# Altium schematic sheet SMPS.SchDoc
size A4; SheetNumber: 4; SheetTotal: 7
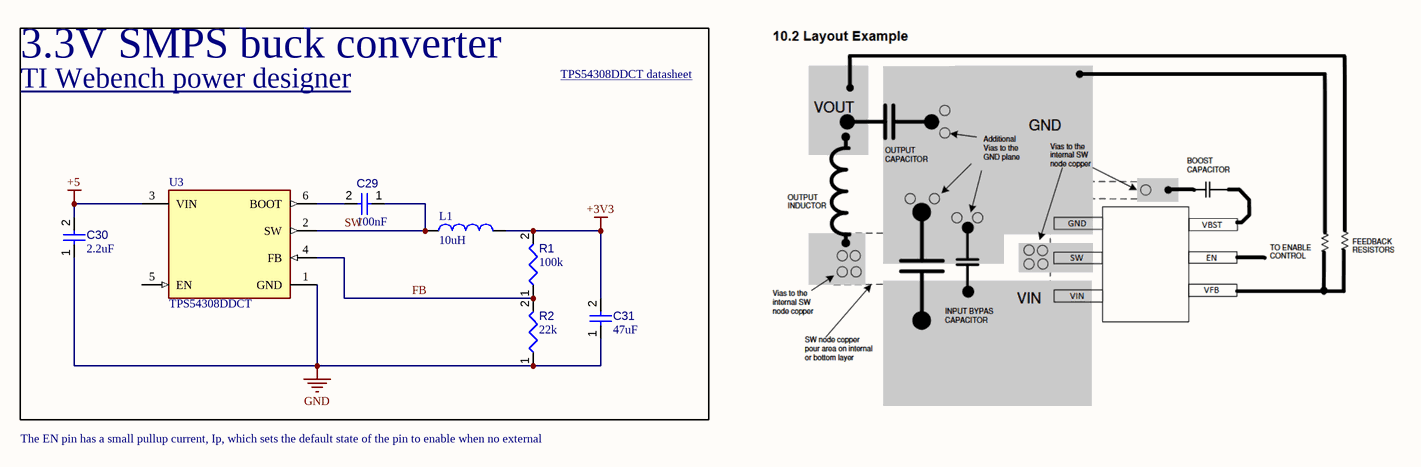
[diagram p0: SMPS.SchDoc]

## Parts
C29  value 100nF  [CAPC0805(2012)145_L]  (hidden comment: Capacitor 4.7µF +/-40% 25V 0805)
C30  value 2.2uF  [CAPC0603(1608)100_L]  (hidden comment: Capacitor 4.7µF +/-20% 10V 0603)
C31  value 47uF  [CAPC1608X90X35ML15T15]  (hidden comment: Capacitor 1uF +/- 10% 16V 0603)
L1  10uH  [WE-PD2A_7850]
R1  value 100k  [RESC0402(1005)_L]  (hidden comment: 121KR2F)
R2  value 22k  [RESC0603(1608)_L]  (hidden comment: 120R3J)
U3  TPS54308DDCT  [FP-DDC0006A-IPC_A]

## Nets
+3V3: C31.2 L1.2 R1.2
+5: C30.2 U3.3(VIN)
GND: C30.1 C31.1 R2.1 U3.1(GND)
FB: R1.1 R2.2 U3.4(FB)
SW: C29.1 L1.1 U3.2(SW)
NetC29_2: C29.2 U3.6(BOOT)

Not connected (* = marked no-connect by the designer): U3 5(EN)

## Notes on the sheet
- 3.3V SMPS buck converter
- TI Webench power designer <https://webench.ti.com/power-designer/switching-regulator>
- TPS54308DDCT datasheet <https://www.ti.com/lit/ds/symlink/tps54308.pdf>
- The EN pin has a small pullup current, Ip, which sets the default state of the pin to enable when no external

## Library data of the parts
C29 = CMP-001-00080-4: Chip Capacitor, 4.7µF +/-40%, 25V, 0805, Thickness 1.45 mm; Tolerance: 20%; Voltage Rating: 25V; Min Operating Temperature: -55°C; Max Operating Temperature: 85°C; Pins: 2; Mounting Technology: SMT; Case/Package: 0805
C30 = CMP-001-00076-4: Chip Capacitor, 4.7µF +/-20%, 10V, 0603, Thickness 1 mm; Tolerance: 10%; Mounting Technology: SMT; Case/Package: 0603; Pins: 2; Min Operating Temperature: -55°C; Max Operating Temperature: 85°C; Voltage Rating: 10V
C31 = CMP-001-00004-6: Chip Capacitor, 1 uF, +/- 10%, 16 V, 0603 (1608 Metric); Capacitor Type: Ceramic; Mounting Technology: SM; RoHS Compliant: True; Min Operating Temperature: -55°C; Case/Package: 0603; Pins: 2; Voltage Rating: 16V; Max Operating Temperature: 125°C; Tolerance: 10%
L1 = CMP-03913-56466919-1: 78477510 Inductor, Aec-Q200, 10Uh, Unshld, 2.3A Rohs Compliant: Yes; Voltage Rating: 80V; Shielding: Unshielded; Tolerance: 20%; DC Resistance (DCR): 40mΩ; Saturation Current: 2.95A; Inductance: 10µH; Core Material: Ferrite; Self Resonant Frequency: 23MHz; Test Frequency: 10kHz; Composition: Wirewound; Width: 7.8mm; Ambient Temperature Range Low: -40°C; RoHS: Compliant; Ambient Temperature Range High: 85°C; Height: 5mm; Number of Pins: 2; Current Rating: 2.3A; Mount: Surface Mount; Min Operating Temperature: -40°C; NexarPartId: 56466919; Ratings: AEC-Q200; Height - Seated (Max): 5.5118mm; Case/Package: Nonstandard; Max Operating Temperature: 125°C; Length: 7mm
R1 = CMP-009-00070-2: 121K 0.063W 1% 0402 (1005 Metric)  SMD; Power: 63mW; Case/Package: 0402; Pins: 2; Tolerance: 1%; Mounting Technology: SMT
R2 = CMP-009-00069-2: 120R 0.1W 5% 0603 (1608 Metric)  SMD; Power: 100mW; Mounting Technology: SMT; Tolerance: 5%; Case/Package: 0603; Pins: 2
U3 = CMP-04918-000241-1: IC REG BUCK ADJ 3A TSOT23-6; Max Input Voltage: 28V; Synchronous Rectifier: Yes; Max Output Voltage: 26V; Switching Frequency: 350kHz; Number of Outputs: 1; Output Configuration: Positive; Output Type: Adjustable; Min Input Voltage: 4.5V; Min Output Voltage: 1V; Min Operating Temperature: -40°C; Case/Package: SOT-23-6; Mount: Surface Mount; RoHS Compliant: Yes; Max Operating Temperature: 125°C; Output Current: 3A; Packaging: Tape and Reel